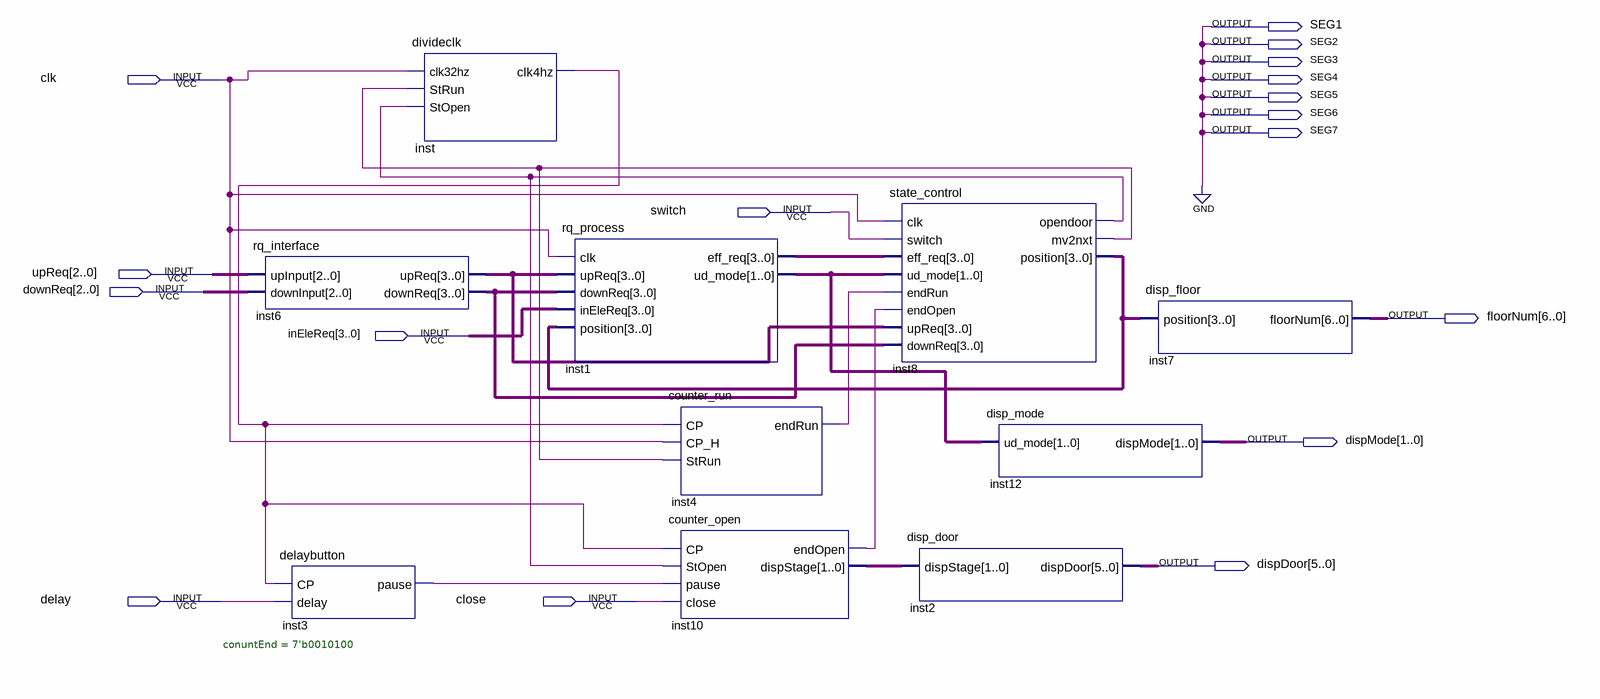
[diagram p0: schematic sheet]
// Quartus schematic myElevator.bdf as structural Verilog: 10 symbols, 17 pins
module myElevator (
  input  clk,
  input  switch,
  input  [2:0] upReq,
  input  [2:0] downReq,
  input  [3:0] inEleReq,
  input  delay,
  input  close,
  output SEG1,
  output SEG2,
  output SEG3,
  output SEG4,
  output SEG5,
  output SEG6,
  output SEG7,
  output [6:0] floorNum,
  output [1:0] dispMode,
  output [5:0] dispDoor
);

  wire inst3_pause, inst4_endrun, inst8_mv2nxt, inst8_opendoor, inst10_endopen, inst_clk4hz;
  wire [1:0] inst1_ud_mode, inst10_dispstage;
  wire [3:0] inst1_eff_req, inst6_downreq, inst6_upreq, inst8_position;

  rq_interface inst6 (.upInput(upReq), .downInput(downReq), .upReq(inst6_upreq), .downReq(inst6_downreq));
  delaybutton #(.conuntEnd(7'b0010100)) inst3 (.CP(inst_clk4hz), .delay(delay), .pause(inst3_pause));
  divideclk inst (.clk32hz(clk), .StRun(inst8_mv2nxt), .StOpen(inst8_opendoor), .clk4hz(inst_clk4hz));
  rq_process inst1 (
    .clk(clk), .upReq(inst6_upreq), .downReq(inst6_downreq), .inEleReq(inEleReq), .position(inst8_position),
    .eff_req(inst1_eff_req), .ud_mode(inst1_ud_mode));
  counter_run inst4 (.CP(inst_clk4hz), .CP_H(clk), .StRun(inst8_mv2nxt), .endRun(inst4_endrun));
  counter_open inst10 (
    .CP(inst_clk4hz), .StOpen(inst8_opendoor), .pause(inst3_pause), .close(close), .endOpen(inst10_endopen),
    .dispStage(inst10_dispstage));
  state_control inst8 (
    .clk(clk), .switch(switch), .eff_req(inst1_eff_req), .ud_mode(inst1_ud_mode), .endRun(inst4_endrun),
    .endOpen(inst10_endopen), .upReq(inst6_upreq), .downReq(inst6_downreq), .opendoor(inst8_opendoor),
    .mv2nxt(inst8_mv2nxt), .position(inst8_position));
  disp_door inst2 (.dispStage(inst10_dispstage), .dispDoor(dispDoor));
  disp_mode inst12 (.ud_mode(inst1_ud_mode), .dispMode(dispMode));
  disp_floor inst7 (.position(inst8_position), .floorNum(floorNum));

  assign SEG1 = 1'b0;
  assign SEG2 = 1'b0;
  assign SEG3 = 1'b0;
  assign SEG4 = 1'b0;
  assign SEG5 = 1'b0;
  assign SEG6 = 1'b0;
  assign SEG7 = 1'b0;
endmodule
